# EAGLE design pic32 (EAGLE 8.1.0)
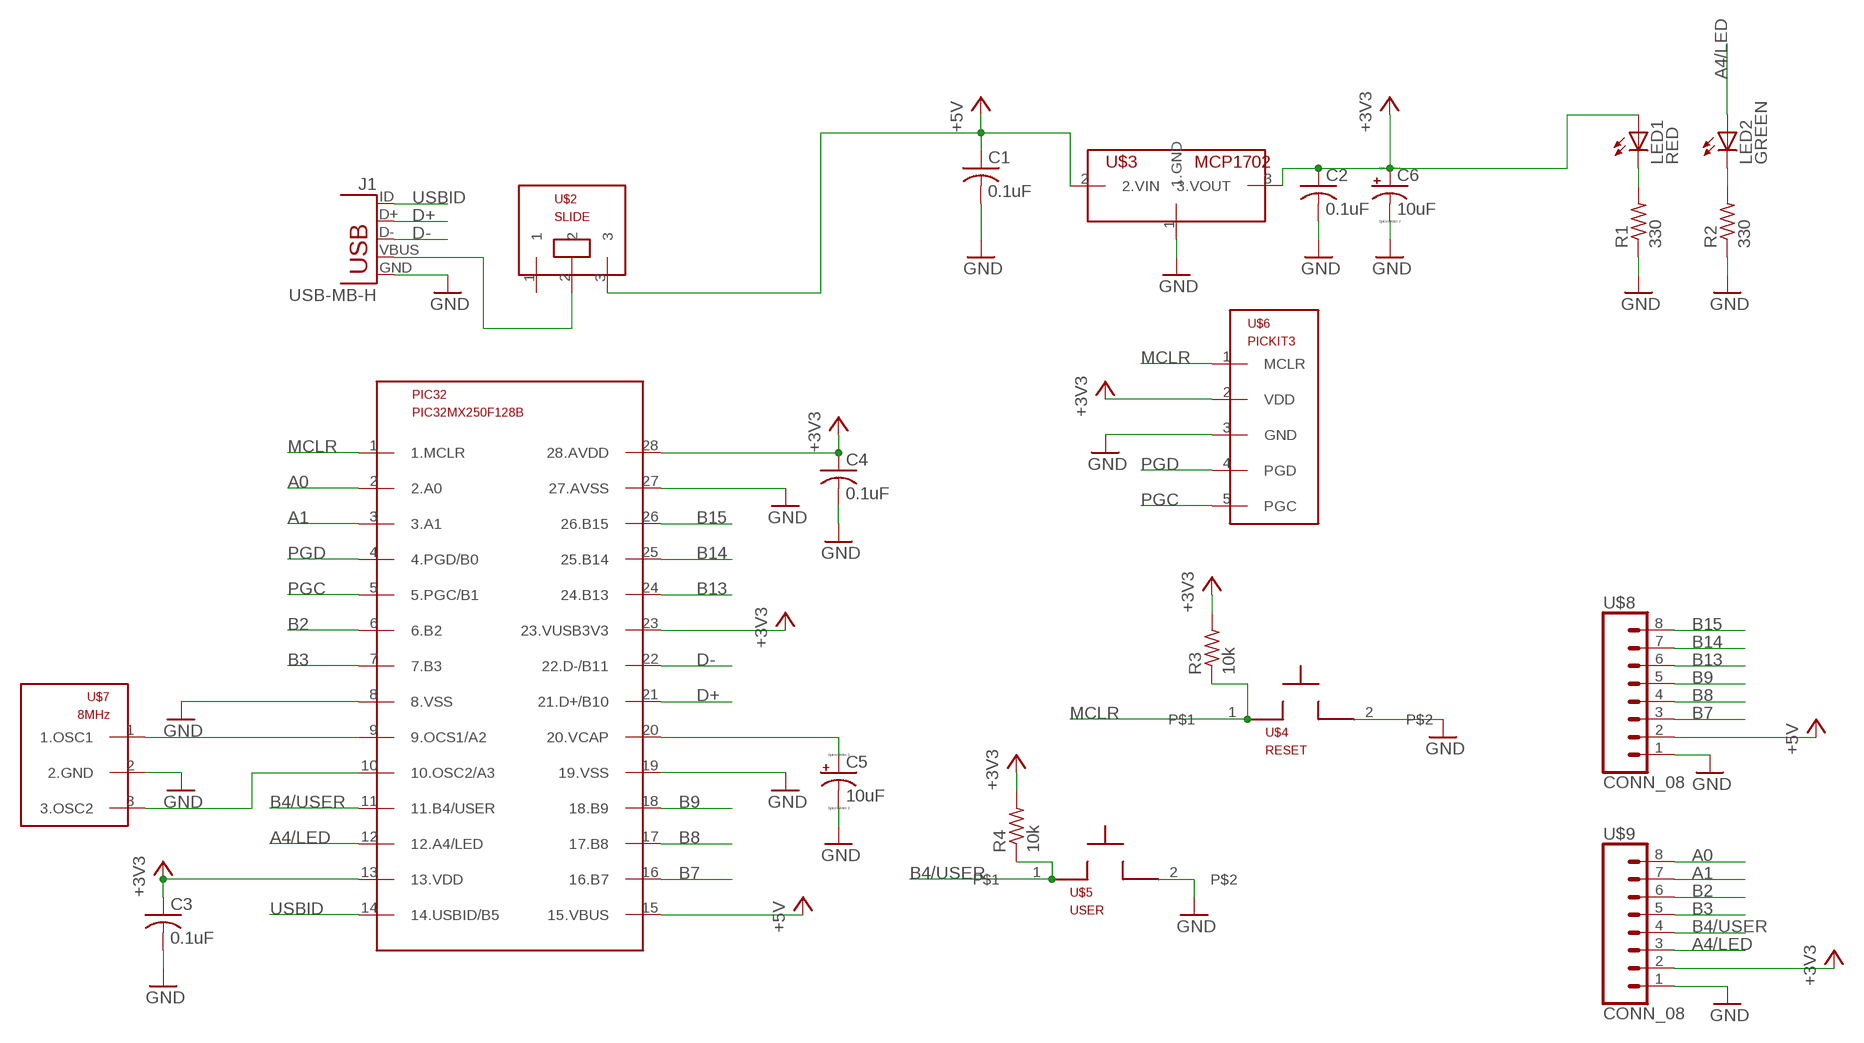
[diagram p0: schematic, sheet 1]

## Parts
C1  0.1uF  C-US025-025X050  [C025-025X050]
C2  0.1uF  C-US025-025X050  [C025-025X050]
C3  0.1uF  C-US025-025X050  [C025-025X050]
C4  0.1uF  C-US025-025X050  [C025-025X050]
C5  10uF  CPOL-USB45181B  [B45181B]
C6  10uF  CPOL-USB45181B  [B45181B]
J1  USB-MB-H  [USB-MB-H]
LED1  RED  LED3MM  [LED3MM]
LED2  GREEN  LED3MM  [LED3MM]
PIC32  PIC32MX250F128B  [DIL28-3]
R1  330  R-US_0207/10  [0207/10]
R2  330  R-US_0207/10  [0207/10]
R3  10k  R-US_0207/10  [0207/10]
R4  10k  R-US_0207/10  [0207/10]
U$2  SLIDE  [SLIDE]
U$3  MCP1702  [TO92]
U$4  RESET  PB  [PB]
U$5  USER  PB  [PB]
U$6  PICKIT3  [1X05]
U$7  8MHz  OCS  [OSC]
U$8  CONN_08  [1X08]
U$9  CONN_08  [1X08]

## Nets
+3V3: C2.1 C3.1 C4.1 C6.+ LED1.A PIC32.13(13.VDD) PIC32.23(23.VUSB3V3) PIC32.28(28.AVDD) R3.2 R4.2 U$3.3(3.VOUT) U$6.2(VDD) U$9.2
+5V: C1.1 PIC32.15(15.VBUS) U$2.3 U$3.2(2.VIN) U$8.2
A0: PIC32.2(2.A0) U$9.8
A1: PIC32.3(3.A1) U$9.7
A4/LED: LED2.A PIC32.12(12.A4/LED) U$9.3
B2: PIC32.6(6.B2) U$9.6
B3: PIC32.7(7.B3) U$9.5
B4/USER: PIC32.11(11.B4/USER) R4.1 U$5.1 U$9.4
B7: PIC32.16(16.B7) U$8.3
B8: PIC32.17(17.B8) U$8.4
B9: PIC32.18(18.B9) U$8.5
B13: PIC32.24(24.B13) U$8.6
B14: PIC32.25(25.B14) U$8.7
B15: PIC32.26(26.B15) U$8.8
D+: J1.D+ PIC32.21(21.D+/B10)
D-: J1.D- PIC32.22(22.D-/B11)
GND: C1.2 C2.2 C3.2 C4.2 C5.- C6.- J1.GND PIC32.8(8.VSS) PIC32.19(19.VSS) PIC32.27(27.AVSS) R1.1 R2.1 U$3.1(1.GND) U$4.2 U$5.2 U$6.3(GND) U$7.2(2.GND) U$8.1 U$9.1
MCLR: PIC32.1(1.MCLR) R3.1 U$4.1 U$6.1(MCLR)
N$1: J1.VBUS U$2.2
N$2: PIC32.10(10.OSC2/A3) U$7.3(3.OSC2)
N$3: LED1.K(C) R1.2
N$4: LED2.K(C) R2.2
N$5: PIC32.9(9.OCS1/A2) U$7.1(1.OSC1)
N$6: C5.+ PIC32.20(20.VCAP)
PGC: PIC32.5(5.PGC/B1) U$6.5(PGC)
PGD: PIC32.4(4.PGD/B0) U$6.4(PGD)
USBID: J1.ID PIC32.14(14.USBID/B5)
Unconnected: U$2.1

## Library data of the parts
C1-C4 = me433:C-US: CAPACITOR, American symbol
C5 C6 = me433:CPOL-US: POLARIZED CAPACITOR, American symbol
J1 = me433:USB: USB Connectors USB-B-PTH is fully proven SKU : PRT-00139/CONN-08278 USB-miniB is fully proven SKU : PRT-00587 USB-A-PCB is untested. USB-A-H is throughly reviewed, but untested. Spark Fun Electronics SKU : PRT-00437 USB-B-SMT is throughly reviewed, but untested. Needs silkscreen touching up. USB-A-S has not been used/tested USB-MB-H has not been used/tested USB-MICROB has been used. CONN-09505
LED1 LED2 = me433:LED: LED OSRAM: - CHIPLED LG R971, LG N971, LY N971, LG Q971, LY Q971, LO R971, LY R971 LH N974, LH R974 LS Q976, LO Q976, LY Q976 LO Q996 - Hyper CHIPLED LW Q18S LB Q993, LB Q99A, LB R99A - SideLED LS A670, LO A670, LY A670, LG A670, LP A670 LB A673, LV A673, LT A673, LW A673 LH A674 LY A675 LS A676, LA A676, LO A676, LY A676, LW A676 LS A679, LY A679, LG A679 - Hyper Micro SIDELED® LS Y876, LA Y876, LO Y876, LY Y876 LT Y87S - SmartLED LW L88C, LW L88S LB L89C, LB L89S, LG L890 LS L89K, LO L89K, LY L89K LS L896, LA L896, LO L896, LY L896 - TOPLED LS T670, LO T670, LY T670, LG T670, LP T670 LSG T670, LSP T670, LSY T670, LOP T670, LYG T670 LG T671, LOG T671, LSG T671 LB T673, LV T673, LT T673, LW T673 LH T674 LS T676, LA T676, LO T676, LY T676, LB T676, LH T676, LSB T676, LW T676 LB T67C, LV T67C, LT T67C, LS T67K, LO T67K, LY T67K, LW E67C LS E67B, LA E67B, LO E67B, LY E67B, LB E67C, LV E67C, LT E67C LW T67C LS T679, LY T679, LG T679 LS T770, LO T770, LY T770, LG T770, LP T770 LB T773, LV T773, LT T773, LW T773 LH T774 LS E675, LA E675, LY E675, LS T675 LS T776, LA T776, LO T776, LY T776, LB T776 LHGB T686 LT T68C, LB T68C - Hyper Mini TOPLED® LB M676 - Mini TOPLED Santana® LG M470 LS M47K, LO M47K, LY M47K Source: http://www.osram.convergy.de LUXEON: - LUMILED® LXK2-PW12-R00, LXK2-PW12-S00, LXK2-PW14-U00, LXK2-PW14-V00 LXK2-PM12-R00, LXK2-PM12-S00, LXK2-PM14-U00 LXK2-PE12-Q00, LXK2-PE12-R00, LXK2-PE12-S00, LXK2-PE14-T00, LXK2-PE14-U00 LXK2-PB12-K00, LXK2-PB12-L00, LXK2-PB12-M00, LXK2-PB14-N00, LXK2-PB14-P00, LXK2-PB14-Q00 LXK2-PR12-L00, LXK2-PR12-M00, LXK2-PR14-Q00, LXK2-PR14-R00 LXK2-PD12-Q00, LXK2-PD12-R00, LXK2-PD12-S00 LXK2-PH12-R00, LXK2-PH12-S00 LXK2-PL12-P00, LXK2-PL12-Q00, LXK2-PL12-R00 Source: www.luxeon.com KINGBRIGHT: KA-3528ASYC Source: www.kingbright.com
PIC32 = me433:PIC32MX250F128B
R1-R4 = me433:R-US_: RESISTOR, American symbol
U$2 = me433:SLIDE
U$3 = me433:MCP1702
U$4 U$5 = me433:PB
U$6 = me433:PICKIT3
U$7 = me433:OCS
U$8 U$9 = me433:CONN_08

## Board
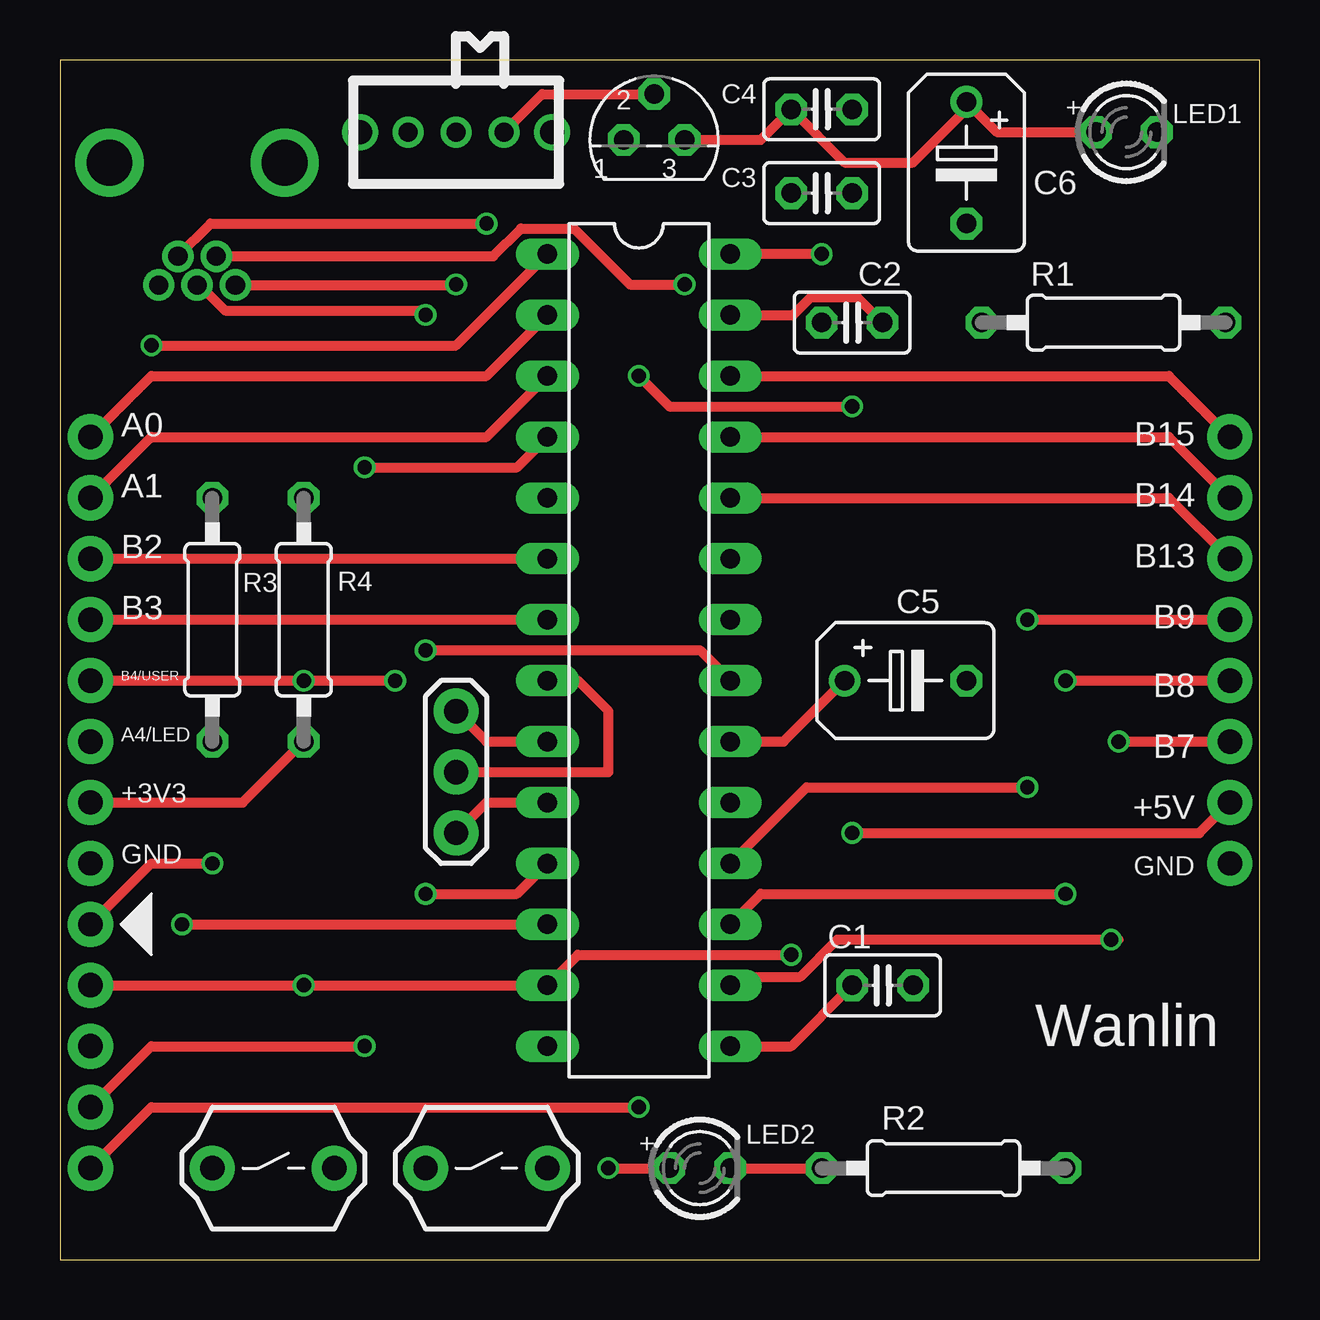
[diagram p1: board, top side]
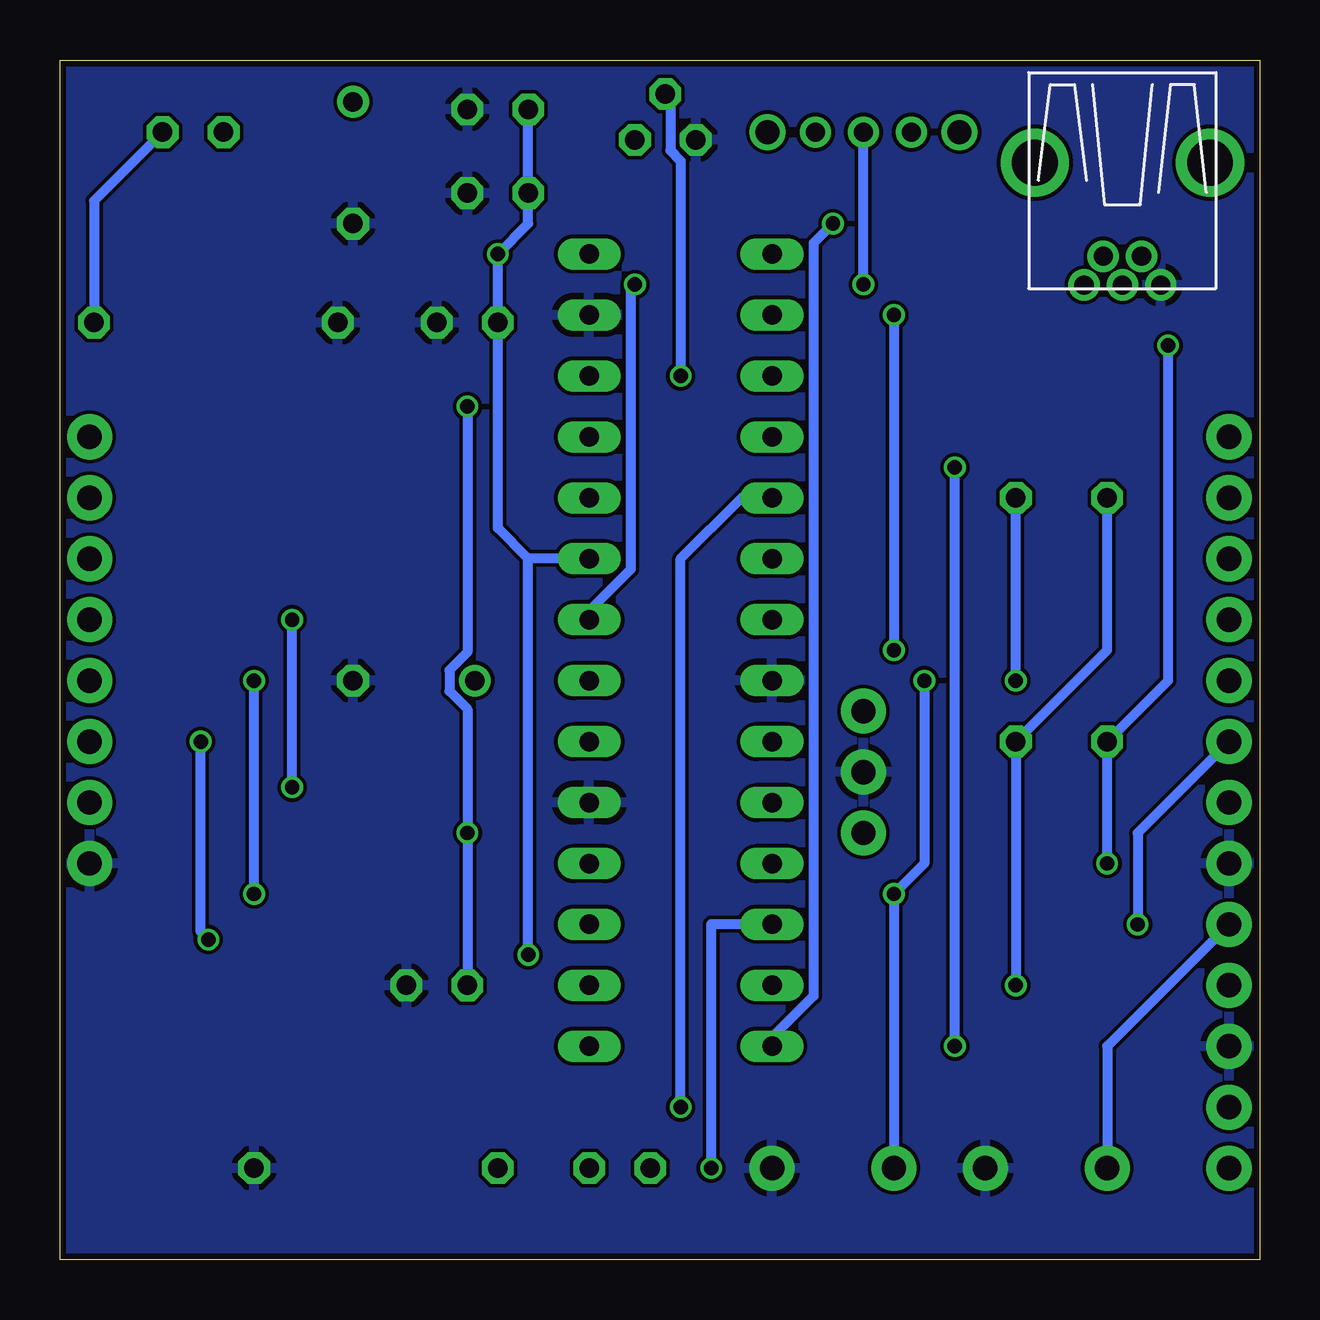
[diagram p2: board, bottom side, seen from below]

Size 50 x 50 mm. Coordinates in mm from the lower left corner, seen from the top.
Outline: 0,0 50,0 50,50 0,50 0,0
Copper layers (1*16): Top 0.035mm / dielectric 1.5mm / Bottom 0.035mm
Design rules "SeeedStudio_2layer_DRU_no_angle_20140221": minimum track width 6mil, minimum drill 12mil, track to track 6mil, track to pad 6mil, pad to pad 6mil, via to via 6mil, smd to smd 0mil, copper to edge 10mil, drill to drill 10mil, minimum pad ring 10mil, minimum via ring 6mil, stop-mask expansion 2mil, vias tented up to drill 100mil, thermal gap 10mil

### Footprints (pad centres in the part's own frame; a part is rotated, then mirrored left to right if it is on the bottom)
C025-025X050 = drill 0.813 octagon: 1 -1.27,0; 2 1.27,0
B45181B = drill 0.813: + -2.54,0 | drill 0.813 octagon: - 2.54,0
USB-MB-H = drill 0.8: D+ 5.1,0; D- 3.9,0.8; GND 5.1,-1.6; ID 3.9,-0.8; VBUS 5.1,1.6 | drill 1.9: P$6 0,-3.65; P$7 0,3.65
LED3MM = drill 0.813 octagon: A -1.27,0; K 1.27,0
DIL28-3 = drill 0.813 long: 1 -16.51,-3.81; 2 -13.97,-3.81; 3 -11.43,-3.81; 4 -8.89,-3.81; 5 -6.35,-3.81; 6 -3.81,-3.81; 7 -1.27,-3.81; 8 1.27,-3.81; 9 3.81,-3.81; 10 6.35,-3.81; 11 8.89,-3.81; 12 11.43,-3.81; 13 13.97,-3.81; 14 16.51,-3.81; 15 16.51,3.81; 16 13.97,3.81; 17 11.43,3.81; 18 8.89,3.81; 19 6.35,3.81; 20 3.81,3.81; 21 1.27,3.81; 22 -1.27,3.81; 23 -3.81,3.81; 24 -6.35,3.81; 25 -8.89,3.81; 26 -11.43,3.81; 27 -13.97,3.81; 28 -16.51,3.81
0207/10 = drill 0.813 octagon: 1 -5.08,0; 2 5.08,0
SLIDE = drill 0.8: 1 -2,0; 2 0,0; 3 2,0 | drill 1: P$1 -4,0; P$2 4,0
TO92 = drill 0.813 octagon: 1 -1.27,0; 2 0,1.905; 3 1.27,0
PB = drill 1.016 pad 1.88: 1 -2.54,0; 2 2.54,0
1X05 = drill 1.016 pad 1.88: 1 0,0; 2 2.54,0; 3 5.08,0; 4 7.62,0; 5 10.16,0
OSC = drill 1.016 pad 1.88: 1 -2.54,0; 2 0,0; 3 2.54,0
1X08 = drill 1.016 pad 1.88: 1 0,0; 2 2.54,0; 3 5.08,0; 4 7.62,0; 5 10.16,0; 6 12.7,0; 7 15.24,0; 8 17.78,0

### Placement (x,y rotation side)
C1  34.29,11.43 0 top
C2  33.02,39.05 0 top
C3  31.75,44.45 0 top
C4  31.75,47.94 0 top
C5  35.24,24.13 0 top
C6  37.78,45.72 270 top
J1  5.71,45.72 270 top
LED1  44.45,46.99 0 top
LED2  26.67,3.81 0 top
PIC32  24.13,25.4 270 top
R1  43.5,39.05 0 top
R2  36.83,3.81 180 top
R3  6.35,26.67 90 top
R4  10.16,26.67 270 top
U$2  16.51,46.99 0 top
U$3  24.77,46.67 0 top
U$4  8.89,3.81 0 top
U$5  17.78,3.81 0 top
U$6  1.27,13.97 270 top
U$7  16.51,20.32 270 top
U$8  48.77,16.51 90 top
U$9  1.27,16.51 90 top

### Tracks (layer width: path | path; a pad name or v marks a point on that pad's centre or on a via)
+3V3  (via drill 0.6)
  Top 0.406: U$9.2 7.62,19.05 R4.2 | U$6.2 v10.16,11.43 PIC32.13 21.59,12.7 v30.48,12.7 | v31.75,41.91 PIC32.28 | LED1.A 39.05,46.99 C6.+ 37.78,47.94 35.56,45.72 32.7,45.72 C4.1 29.21,46.67 U$3.3
  Bottom 0.406: R3.2 6.35,25.4 R4.2 v10.16,11.43 | PIC32.23 30.48,29.21 | v30.48,12.7 30.48,29.21 | 30.48,29.21 31.75,30.48 C2.1 v31.75,41.91 30.48,43.18 C3.1 C4.1
+5V  (via drill 0.6)
  Top 0.406: PIC32.15 30.48,8.89 C1.1 | v33.02,17.78 47.5,17.78 U$8.2 | U$2.3 20.1,48.58 U$3.2 | v24.13,36.83 25.4,35.56 v33.02,35.56
  Bottom 0.406: C1.1 v33.02,17.78 33.02,22.94 33.77,23.69 33.77,24.57 33.02,25.32 v33.02,35.56 | v24.13,36.83 24.13,45.8 24.56,46.23 24.56,48.37 U$3.2
A0
  Top 0.406: U$9.8 3.81,36.83 17.78,36.83 PIC32.2
A1
  Top 0.406: U$9.7 3.81,34.29 17.78,34.29 PIC32.3
A4/LED  (via drill 0.6)
  Top 0.406: v5.08,13.97 PIC32.12 | v22.86,3.81 LED2.A
  Bottom 0.406: U$9.3 5.08,17.78 v5.08,13.97 | PIC32.12 22.86,13.97 v22.86,3.81
B2
  Top 0.406: U$9.6 PIC32.6
B3
  Top 0.406: U$9.5 PIC32.7
B4/USER  (via drill 0.6)
  Top 0.406: U$9.4 v10.16,24.13 v13.97,24.13 | v15.24,15.24 19.05,15.24 PIC32.11
  Bottom 0.406: v10.16,24.13 R4.1 | U$5.1 v15.24,15.24 13.97,16.51 v13.97,24.13
B7  (via drill 0.6)
  Top 0.406: v43.81,13.34 32.4,13.34 30.86,11.79 28.3,11.79 PIC32.16 | v43.81,13.34 44.13,13.34 v43.81,13.34 | v44.13,21.59 U$8.3
  Bottom 0.406: v43.81,13.34 44.13,13.65 v44.13,21.59
B8  (via drill 0.6)
  Top 0.406: PIC32.17 29.21,15.24 v41.91,15.24 | v41.91,24.13 U$8.4
  Bottom 0.406: v41.91,15.24 v41.91,24.13
B9  (via drill 0.6)
  Top 0.406: PIC32.18 31.11,19.68 v40.32,19.68 | v40.32,26.67 U$8.5
  Bottom 0.406: v40.32,19.68 v40.32,26.67
B13
  Top 0.406: PIC32.24 46.23,31.75 U$8.6
B14
  Top 0.406: PIC32.25 46.23,34.29 U$8.7
B15
  Top 0.406: PIC32.26 46.23,36.83 U$8.8
D+  (via drill 0.6)
  Top 0.406: J1.D+ 5.82,40.62 6.88,39.56 15.05,39.56 v15.24,39.37 | v15.24,25.4 26.67,25.4 PIC32.21
  Bottom 0.406: v15.24,39.37 v15.24,25.4
D-  (via drill 0.6)
  Top 0.406: 25.83,40.84 v26.04,40.64 23.76,40.64 21.42,42.98 19.22,42.98 18.06,41.82 J1.D-
  Bottom 0.406: PIC32.22 27.94,27.04 26.21,28.77 26.21,40.46 v26.04,40.64
GND
  Top 0.406: PIC32.27 30.56,39.37 31.31,40.12 33.22,40.12 C2.2 | U$7.2 22.86,20.32 22.86,22.86 21.59,24.13 PIC32.8
  pour Bottom: 0,0 0,50.8 50.8,50.8 50.8,0
MCLR  (via drill 0.6)
  Top 0.406: U$6.1 3.81,16.51 v6.35,16.51 | v3.81,38.1 16.51,38.1 PIC32.1
  Bottom 0.406: v6.35,16.51 R3.1 3.81,24.13 v3.81,38.1 | U$6.1 6.35,8.89 U$4.1
N$1  (via drill 0.6)
  Top 0.406: J1.VBUS 16.51,40.62 v16.51,40.64
  Bottom 0.406: v16.51,40.64 U$2.2
N$2
  Top 0.406: U$7.3 17.78,19.05 PIC32.10
N$3
  Bottom 0.406: LED1.K 48.58,44.13 R1.2
N$4
  Top 0.406: LED2.K R2.2
N$5
  Top 0.406: U$7.1 17.78,21.59 PIC32.9
N$6
  Top 0.406: PIC32.20 30.16,21.59 C5.+
PGC  (via drill 0.6)
  Top 0.406: U$6.5 3.81,6.35 v24.13,6.35
  Bottom 0.406: v24.13,6.35 24.13,29.21 21.59,31.75 PIC32.5
PGD  (via drill 0.6)
  Top 0.406: U$6.4 3.81,8.89 v12.7,8.89 | v12.7,33.02 19.05,33.02 PIC32.4
  Bottom 0.406: v12.7,8.89 v12.7,33.02
USBID  (via drill 0.6)
  Top 0.406: J1.ID 6.28,43.18 v17.78,43.18
  Bottom 0.406: v17.78,43.18 18.59,42.37 18.59,10.99 20.32,9.26 PIC32.14

### Text on the board
tNames: 2 | + | 1 | 3 | B15 | A0 | A1 | B14 | B13 | B2 | B3 | B9 | B4/USER | B8 | A4/LED | B7 | +3V3 | +5V | GND | GND | Wanlin | +